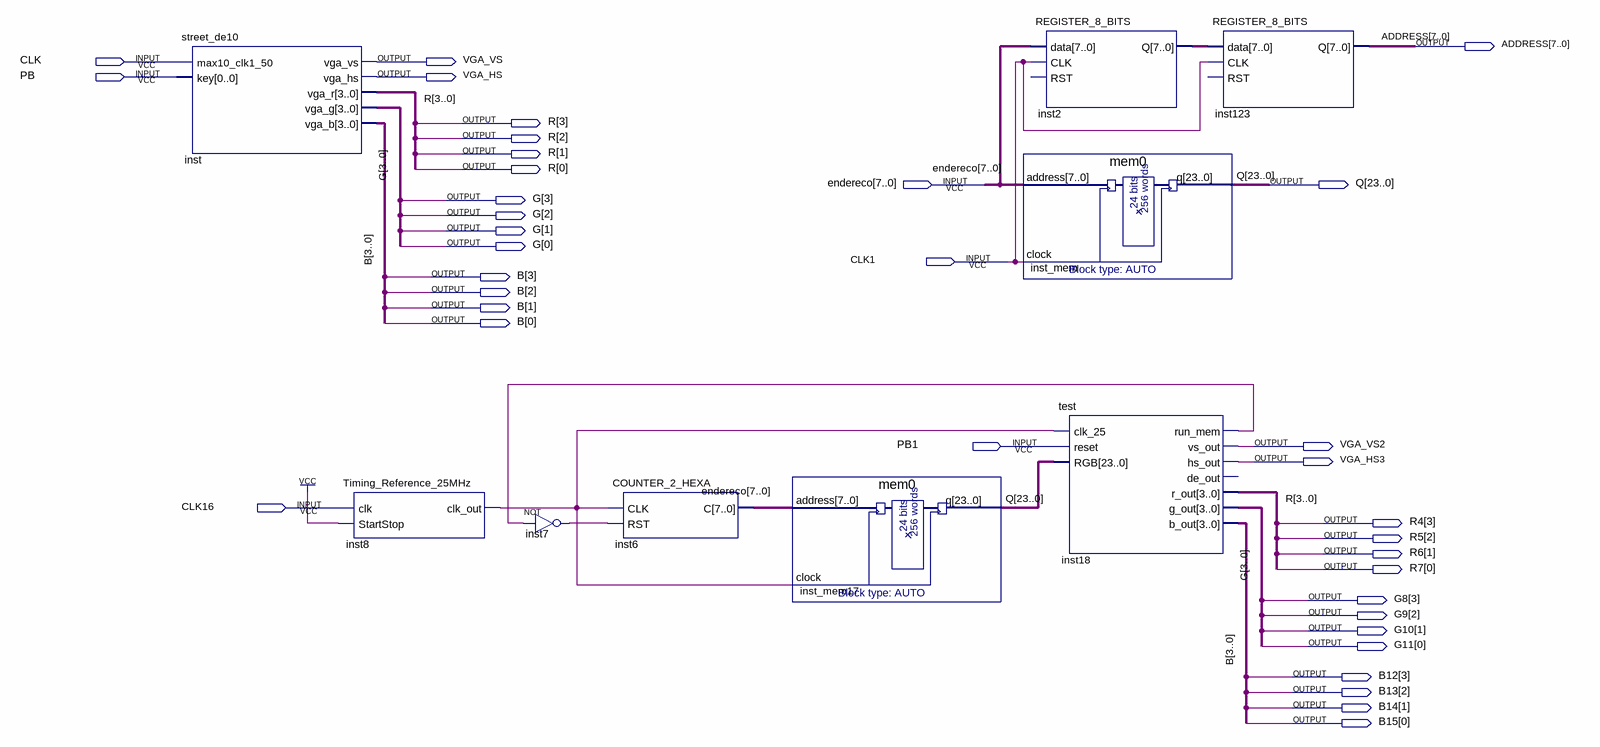
[diagram p0: schematic sheet]
// Quartus schematic tmp.bdf as structural Verilog: 9 symbols, 36 pins
module tmp (
  input  CLK,
  input  PB,
  input  [7:0] endereco,
  input  CLK1,
  input  PB1,
  input  CLK16,
  output [7:0] ADDRESS,
  output VGA_VS,
  output VGA_HS,
  output [3:0] R,
  output [23:0] Q,
  output [3:0] G,
  output [3:0] B,
  output VGA_VS2,
  output VGA_HS3,
  output [3:3] R4,
  output [2:2] R5,
  output [1:1] R6,
  output [0:0] R7,
  output [3:3] G8,
  output [2:2] G9,
  output [1:1] G10,
  output [0:0] G11,
  output [3:3] B12,
  output [2:2] B13,
  output [1:1] B14,
  output [0:0] B15
);

  wire inst7_out, inst8_clk_out, inst18_run_mem;
  wire [7:0] inst2_q;

  street_de10 inst (.max10_clk1_50(CLK), .key(PB), .vga_vs(VGA_VS), .vga_hs(VGA_HS), .vga_r(R), .vga_g(G), .vga_b(B));
  Timing_Reference_25MHz inst8 (.clk(CLK16), .StartStop(1'b1), .clk_out(inst8_clk_out));
  not inst7 (inst7_out, inst18_run_mem);
  COUNTER_2_HEXA inst6 (.CLK(inst8_clk_out), .RST(inst7_out), .C(endereco));
  mem0 inst_mem17 (.address(endereco), .clock(inst8_clk_out), .q(Q));
  REGISTER_8_BITS inst2 (.data(endereco), .CLK(CLK1), .Q(inst2_q));  // open: RST
  mem0 inst_mem (.address(endereco), .clock(CLK1), .q(Q));
  test inst18 (
    .clk_25(inst8_clk_out), .reset(PB1), .RGB(Q), .run_mem(inst18_run_mem), .vs_out(VGA_VS2),
    .hs_out(VGA_HS3), .r_out(R), .g_out(G), .b_out(B));  // open: de_out
  REGISTER_8_BITS inst123 (.data(inst2_q), .CLK(CLK1), .Q(ADDRESS));  // open: RST
endmodule
